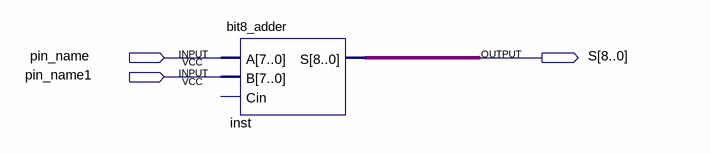
[diagram p0: schematic sheet]
// Quartus schematic er4adder.bdf as structural Verilog: 1 symbols, 3 pins
module er4adder (
  input  pin_name,
  input  pin_name1,
  output [8:0] S
);

  bit8_adder inst (.A({8{pin_name}}), .B({8{pin_name1}}), .S(S));  // open: Cin
endmodule
